# EAGLE design TVbNull-Laser (EAGLE 5.11)
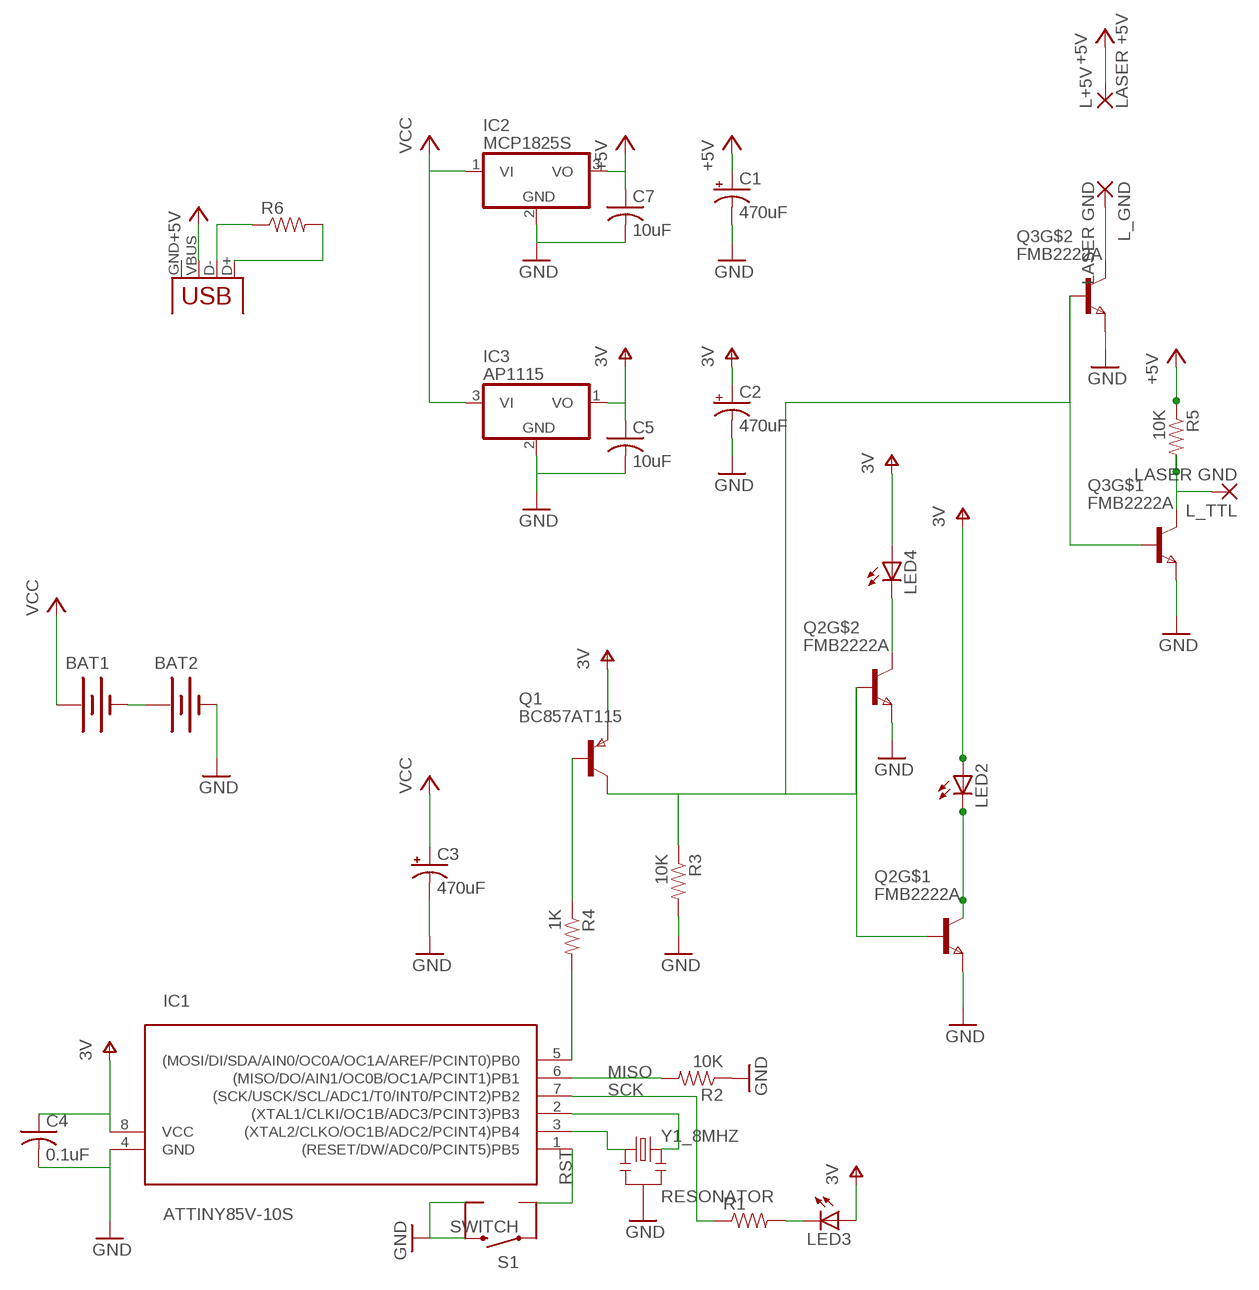
[diagram p0: schematic, sheet 1]

## Parts
BAT1  BATTERYCR123A  [BATTERY_CR123A]
BAT2  BATTERYCR123A  [BATTERY_CR123A]
C1  470uF  CAP_POL7343  [EIA7343]
C2  470uF  CAP_POL7343  [EIA7343]
C3  470uF  CAP_POL7343  [EIA7343]
C4  0.1uF  C-USC0805K  [C0805K]
C5  10uF  C-USC1206  [C1206]
C7  10uF  C-USC1206  [C1206]
IC1  ATTINY85V-10S  [SOIC8]
IC2  MCP1825S  MCP1703DB  [SOT223]
IC3  AP1115  [SOT89]
L+5V  LASER +5V  SMD5  [SMD2,54-5,08]
L_GND  LASER GND  SMD5  [SMD2,54-5,08]
L_TTL  LASER GND  SMD5  [SMD2,54-5,08]
LED2  LEDSIDEIR  [SIDE_IR_NSL]
LED3  LEDCHIPLED_1206  [CHIPLED_1206]
LED4  LEDSIDEIR  [SIDE_IR_NSL]
Q1  BC857AT115  PNPSOT323SOT416  [SOT416]
Q2  FMB2222A  DUALNPN  [SSOT6]
Q3  FMB2222A  DUALNPN  [SSOT6]
R1  1.5K  RESISTOR1206  [1206]
R2  10K  RESISTOR  [0805]
R3  10K  RESISTOR  [0805]
R4  1K  RESISTOR  [0805]
R5  10K  RESISTOR1206  [1206]
R6  RESISTOR0603-RES  [0603-RES]
S1  SWITCH  SWITCH-MOMENTARY-2SMD  [TACTILE_SWITCH_SMD]
X1  USBKUSBX-SMT-AS1N  [KSUBX-SMT-AS1N]
Y1_8MHZ  RESONATOR  RESONATORSMD  [RESONATOR-SMD]

## Nets
+5V: C1.A(+) C7.1 IC2.3(VO) L+5V.1(P) R5.1 X1.VBUS
GND: BAT2.- C1.C(-) C2.C(-) C3.C(-) C4.2 C5.2 C7.2 IC1.4(GND) IC2.2(GND) IC3.2(GND) Q2.2(E) Q2.5(E) Q3.2(E) Q3.5(E) R2.1 R3.2 S1.3 S1.4 Y1_8MHZ.2
MISO: IC1.6((MISO/DO/AIN1/OC0B/OC1A/PCINT1)PB1) R2.2
MOSI: IC1.5((MOSI/DI/SDA/AIN0/OC0A/OC1A/AREF/PCINT0)PB0) R4.2
N$1: IC1.3((XTAL2/CLKO/OC1B/ADC2/PCINT4)PB4) Y1_8MHZ.1
N$2: IC1.2((XTAL1/CLKI/OC1B/ADC3/PCINT3)PB3) Y1_8MHZ.3
N$3: LED3.C R1.2
N$4: LED4.C Q2.4(C)
N$5: LED2.C Q2.6(C)
N$6: Q1.2(B) R4.1
N$7: Q1.1(C) Q2.1(B) Q2.3(B) Q3.1(B) Q3.3(B) R3.1
N$8: BAT1.- BAT2.+
N$9: L_GND.1(P)
N$10: L_TTL.1(P) Q3.6(C) R5.2
N$11: R6.1 X1.D-
N$12: R6.2 X1.D+
RST: IC1.1((RESET/DW/ADC0/PCINT5)PB5) S1.2
SCK: IC1.7((SCK/USCK/SCL/ADC1/T0/INT0/PCINT2)PB2) R1.1
V+: C2.A(+) C4.1 C5.1 IC1.8(VCC) IC3.1(VO) LED2.A LED3.A LED4.A Q1.3(E) ; supply symbol labelled 3V
VCC: BAT1.+ C3.A(+) IC2.1(VI) IC3.3(VI)
Unconnected: Q3.4(C) S1.1 X1.GND

## Library data of the parts
BAT1 BAT2 = SparkFun:BATTERY: Battery Holders Various common sizes : AA, AAA, 20mm coin cell and 12mm coin cell.
C1-C3 = SparkFun:CAP_POL: Capacitor Polarized These are standard SMD and PTH capacitors. Normally 10uF, 47uF, and 100uF in electrolytic and tantalum varieties. Always verify the external diameter of the through hole cap, it varies with capacity, voltage, and manufacturer. The EIA devices should be standard.
C4 = rcl-ez:C-US: CAPACITOR, American symbol
C5 C7 = TVbNull-Laser:C-US: CAPACITOR, American symbol
IC1 = avr:ATTINY85: MICROCONTROLLER 8 Kbytes FLASH 512 bytes EEPROM 512 bytes RAM 4-channel 10 bit ADC USI
IC2 = linear:MCP1703: 250 mA, 16V, Low Quiescent Current LDO Regulator Source: http://ww1.microchip.com/downloads/en/DeviceDoc/22049b.pdf
IC3 = TVbNull-Laser:AP1115
L+5V L_GND L_TTL = wirepad:SMD5: SMD PAD
LED2 LED4 = tvbgone3:LED: LED
LED3 = minimidi:LED: LED
Q1 = zetex:PNPSOT323: PNP TRANSISTOR
Q2 Q3 = fairchild-semic:DUALNPN
R1-R5 = SparkFun:RESISTOR: Resistor Basic schematic elements and footprints for 0603, 1206, and PTH 1/10th watt (small) resistors.
R6 = CR123aBoost:RESISTOR: Resistor Basic schematic elements and footprints for 0603, 1206, and PTH 1/10th watt (small) resistors.
S1 = SparkFun:SWITCH-MOMENTARY-2
X1 = CR123aBoost:USB: USB Connectors USB-B-PTH is fully proven SKU : PRT-00139 USB-miniB is fully proven SKU : PRT-00587 USB-A-PCB is untested. USB-A-H is throughly reviewed, but untested. Spark Fun Electronics SKU : PRT-00437 USB-B-SMT is throughly reviewed, but untested. Needs silkscreen touching up. USB-A-S has not been used/tested USB-MB-H has not been used/tested
Y1_8MHZ = SparkFun:RESONATOR: Resonator Small SMD resonator. This is the itty bitty 10/20MHz resonators with built in caps. CSTCE10M0G55 and CSTCE20M0V53. Footprint has been reviewed closely but hasn't been tested yet.

## Board
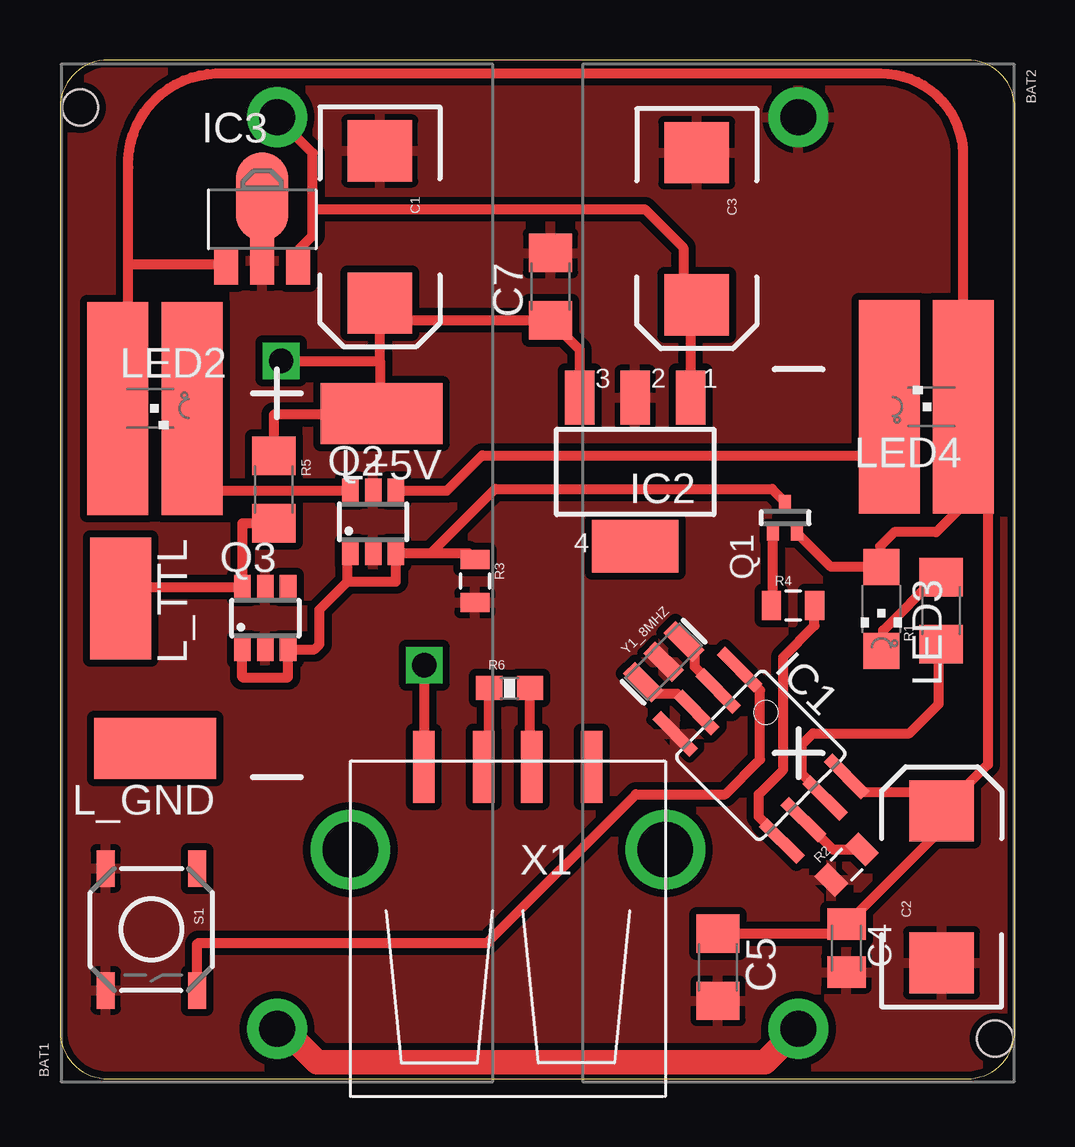
[diagram p1: board, top side]
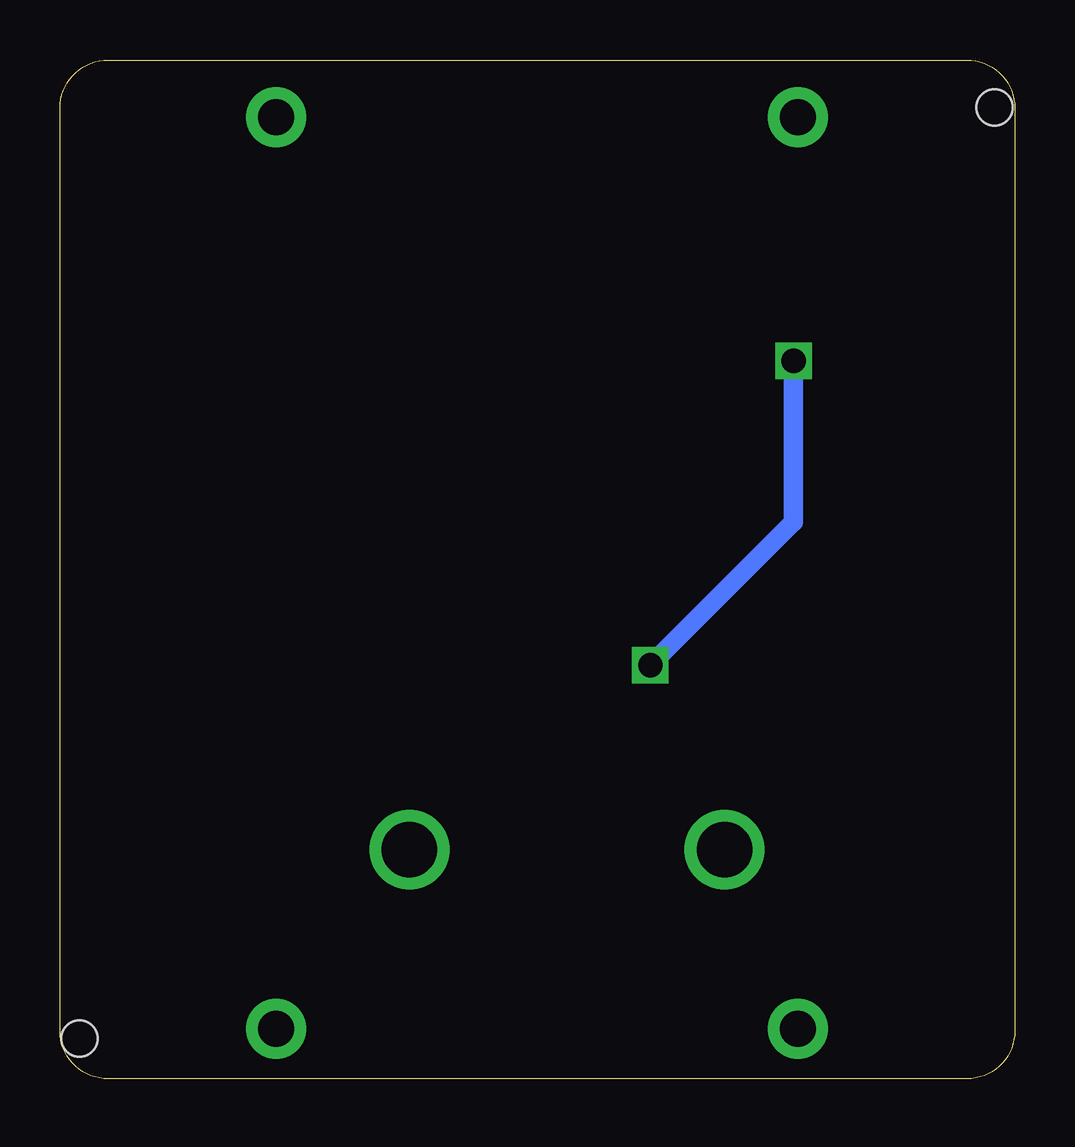
[diagram p2: board, bottom side, seen from below]

Size 39.8 x 42.47 mm. Coordinates in mm from the lower left corner, seen from the top.
Outline: 37.8,0 arc90 39.8,2 39.8,40.47 arc90 37.8,42.47 2,42.47 arc90 0,40.47 0,2 arc90 2,0 37.8,0
Copper layers (1*16): Top 0.0356mm / dielectric 1.5011mm / Bottom 0.0356mm
Design rules "SparkFun-mod": minimum track width 8mil, minimum drill 20mil, track to track 12mil, track to pad 12mil, pad to pad 8mil, via to via 8mil, smd to smd 8mil, copper to edge 12mil, drill to drill 8mil, minimum pad ring 12mil, minimum via ring 10mil, stop-mask expansion 4mil, vias tented up to drill 25mil, thermal gap 10mil

### Footprints (pad centres in the part's own frame; a part is rotated, then mirrored left to right if it is on the bottom)
BATTERY_CR123A = drill 1.5 pad 2.5 round: + 19,0; - -19,0 | hole 1.5: 19.4,8.2
EIA7343 = smd 2.55 x 2.7: A 3.17,0; C -3.17,0
C0805K = smd 1.3 x 1.6: 1 -1,0; 2 1,0
C1206 = smd 1.6 x 1.8: 1 -1.4,0; 2 1.4,0
SOIC8 = smd 0.5 x 2.2: 1 -1.905,-3.154; 2 -0.645,-3.154; 3 0.625,-3.154; 4 1.895,-3.154; 5 1.905,3.154; 6 0.635,3.154; 7 -0.635,3.154; 8 -1.905,3.154
SOT223 = smd 1.219 x 2.235: 1 -2.311,-3.099; 2 0,-3.099; 3 2.311,-3.099 | smd 3.6 x 2.2: 4 0,3.099
SOT89 = smd 1 x 1.5: 1 -1.499,-3.251; 3 1.499,-3.251 | smd 1 x 2: 2 0,-2.997 | smd 2.2 x 3.7: 2@1 0,-0.33
SMD2,54-5,08 = smd 2.54 x 5.08: 1 0,0
SIDE_IR_NSL = smd 2.54 x 8.89: A -1.547,0; C 1.547,0
CHIPLED_1206 = smd 1.5 x 1.5: A 0,-1.75; C 0,1.75
SOT416 = smd 0.6 x 0.5: 1 -0.65,0; 2 0.65,-0.5; 3 0.65,0.5
SSOT6 = smd 0.69 x 0.99: 1 -0.95,-1.3; 2 0,-1.3; 3 0.95,-1.3; 4 0.95,1.3; 5 0,1.3; 6 -0.95,1.3
1206 = smd 1.6 x 1.8: 1 -1.4,0; 2 1.4,0
0805 = smd 0.8 x 1.2: 1 -0.9,0; 2 0.9,0
0603-RES = smd 1.1 x 1: 1 -0.85,0; 2 0.85,0
TACTILE_SWITCH_SMD = smd 1.524 x 0.762: 1 -2.54,1.905; 2 2.54,1.905; 3 -2.54,-1.905; 4 2.54,-1.905
KSUBX-SMT-AS1N = smd 3 x 0.9: D+ 3.45,-1; D- 3.45,1; GND 3.45,-3.5; VBUS 3.45,3.5 | drill 2.311 round: P$5 0,-6.566; P$6 0,6.566
RESONATOR-SMD = smd 0.7 x 1.7: 1 -1.2,0; 2 0,0; 3 1.2,0

### Placement (x,y rotation side)
BAT1  9.04,21.08 90 top
BAT2  30.78,21.08 270 top
C1  13.34,35.51 270 top
C2  36.75,8 90 top
C3  26.54,35.43 270 top
C4  32.78,5.45 270 top
C5  27.43,4.65 270 top
C7  20.45,33.02 90 top
IC1  29.21,13.48 225 top
IC2  23.98,25.3 180 top
IC3  8.43,37.11 0 top
L+5V  13.41,27.74 90 top
L_GND  3.96,13.77 90 top
L_TTL  2.54,20.02 180 top
LED2  3.96,27.94 0 top
LED3  34.24,19.58 180 top
LED4  36.12,28.02 180 top
Q1  30.23,23.39 270 top
Q2  13.06,23.22 0 top
Q3  8.56,19.2 0 top
R1  36.73,19.51 90 top
R2  32.79,8.92 45 top
R3  17.3,20.75 270 top
R4  30.56,19.73 0 top
R5  8.92,24.56 270 top
R6  18.75,16.28 0 top
S1  3.81,6.22 270 top
X1  18.67,9.55 90 top
Y1_8MHZ  25.16,17.39 45 top

### Tracks (layer width: path | path; a pad name or v marks a point on that pad's centre or on a via)
+5V  (via drill 1.02)
  Top 0.406: R5.1 8.91,27.69 13.41,27.69 L+5V.1 13.34,27.81 13.34,28.8 13.34,29.92 | IC2.3 21.67,30.4 C7.1 14.05,31.62 C1.A 13.34,29.92 | X1.VBUS 15.19,13.02 v15.19,17.25 | v9.22,29.92 13.34,29.92
  Bottom 0.813: v15.19,17.25 9.22,23.22 v9.22,29.92
GND
  pour Top: -0.81,43.28 40.23,43.28 40.23,-0.81 -0.81,-0.81
MISO
  Top 0.406: IC1.6 30.99,10.79 32.22,9.56 R2.2
MOSI
  Top 0.406: IC1.5 30.1,9.96 29.13,10.92 29.13,11.86 30.15,12.88 30.15,17.58 31.46,18.89 R4.2
N$1
  Top 0.406: IC1.3 25.89,15.93 25.86,15.93 25.73,16.05 24.79,16.05 Y1_8MHZ.1
N$2
  Top 0.406: IC1.2 26.8,16.81 26.8,16.84 26.47,17.17 26.47,17.75 26.01,18.21 Y1_8MHZ.3
N$3
  Top 0.406: R1.2 36.53,20.91 34.31,18.69 34.31,17.91 LED3.C
N$4
  Top 0.406: Q2.4 16.13,24.52 17.6,25.98 34.44,25.98 34.57,25.86 LED4.C
N$5
  Top 0.406: Q2.6 5.51,24.52 LED2.C
N$6
  Top 0.406: 29.68,22.7 Q1.2 29.73,19.8 R4.1
N$7
  Top 0.406: 15.46,21.92 18.14,24.59 29.68,24.59 Q1.1 | 15.46,21.92 Q2.3 14.01,20.73 11.99,20.73 | 11.99,20.73 11.99,21.92 Q2.1 | R3.1 17.03,21.92 15.46,21.92 | 11.99,20.73 10.82,19.56 10.82,18.11 10.61,17.9 Q3.3 9.51,16.74 7.59,16.74 7.59,17.9 Q3.1
N$8
  Top 1.016: BAT2.+ 29.39,0.69 10.72,0.69 9.32,2.08 BAT1.-
N$10
  Top 0.406: R5.2 7.61,23.16 Q3.6 2.44,20.5 2.44,20.52 2.54,20.52 L_TTL.1
N$11
  Top 0.406: X1.D- 17.89,13.23 R6.1
N$12
  Top 0.406: X1.D+ 19.59,13.07 R6.2
RST
  Top 0.406: IC1.1 29.18,16.2 29.18,13.31 27.74,11.86 24,11.86 17.8,5.66 5.77,5.66 5.71,5.61 S1.2
SCK
  Top 0.406: R1.1 36.63,18.01 36.63,15.62 35.41,14.4 31.39,14.4 30.94,13.95 30.94,12.7 31.89,11.74 IC1.7
V+
  Top 0.406: LED2.A 2.46,27.89 2.46,27.43 2.84,27.81 2.84,33.96 | 2.84,33.96 2.84,38 arc-90 6.5,41.91 34.21,41.91 arc-90 37.64,38.48 37.64,28.04 arc90 LED4.A | C2.A 36.75,10.42 C4.1 32.38,6.05 C5.1 | LED4.A 38.68,28.02 38.68,13.1 C2.A | LED4.A 37.67,23.92 36.52,22.78 34.77,22.78 34.19,22.2 34.19,21.38 LED3.A 32.14,21.33 Q1.3 | IC3.1 6.83,33.96 2.84,33.96 | C2.A 35.99,11.94 33.4,11.94 32.79,12.55 IC1.8
VCC
  Top 0.406: IC3.3 9.93,34.54 10.54,35.15 10.54,36.14 | 10.54,36.22 10.54,38.58 BAT1.+ | 10.54,36.14 10.57,36.12 | 10.54,36.14 10.54,36.22 | 10.54,36.22 10.57,36.25 24.38,36.25 25.98,34.65 25.98,32.52 C3.A 26.29,32.01 IC2.1